# Altium schematic sheet adc.SchDoc: ADC
size A4; Organization: Altium Limited; Address1: L3, 12a Rodborough Rd; Address2: Frenchs Forest; Address3: NSW; Address4: Australia 2086; DocumentNumber: 1; Revision: 1
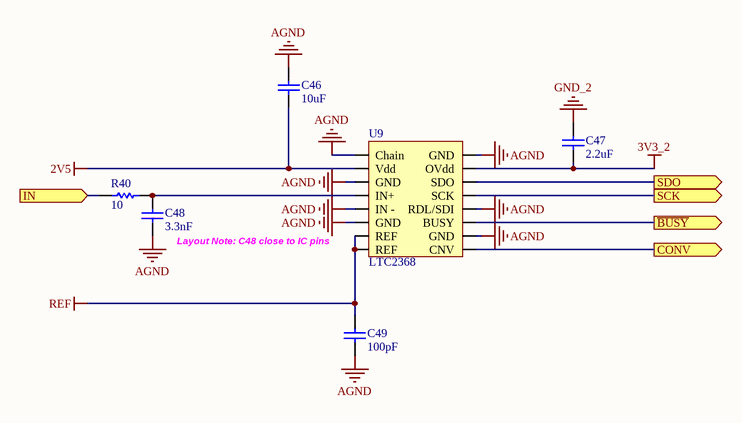
[diagram p0: adc.SchDoc]

## Parts
C46  10uF  [0402_Cap]
C47  2.2uF  [0402_Cap]
C48  3.3nF  [0402_Cap]
C49  100pF  [STD_0805_C]
R40  10  [0402_Res]
U9  LTC2368  [MSOP_16]

## Ports
CONV (out), IN (in), SCK (out), SDO (out), ~{BUSY} (out)

## Nets
2V5: C46.1 U9.2(Vdd)
3V3_2: C47.1 U9.15(OVdd)
AGND: C46.2 C48.1 C49.1 U9.1(Chain) U9.3(GND) U9.5(IN_-) U9.6(GND) U9.10(GND) U9.12(RDL/SDI) U9.16(GND)
GND_2: C47.2
REF: C49.2 U9.7(REF) U9.8(REF)
~{BUSY}: U9.11(BUSY) ; port ~{BUSY}
CONV: U9.9(CNV) ; port CONV
IN: R40.1 ; port IN
SCK: U9.13(SCK) ; port SCK
SDO: U9.14(SDO) ; port SDO
NetC48_2: C48.2 R40.2 U9.4(IN+)

## Notes on the sheet
- Layout Note: C48 close to IC pins
- Title
- Date:
- RE:
- Arturo di Girolamo
- Size:
- A3
- A

## Library data of the parts
C46 = CL21A106KAFN3NE: Capacitor, 10uF, 0805; Value: .01uf; ASYPN: CL05A106MQ5NUNC; MFGPN: CL21A106KAFN3NE
C47 = CL21A225KAFNNNE: Capacitor, 2.2uF, 0805; Value: .01uf; ASYPN: CL05A225KP5NNNC; MFGPN: CL21A225KAFNNNE
C48 = C0805C332KARACAUTO: Capacitor, 3.3nF, 0805; Value: .01uf; ASYPN: GRM1557U1A332JA01D; MFGPN: C0805C332KARACAUTO
C49 = CL21C101JCANNNC: Capacitor, 100pF, 0805; Value: .01uf; ASYPN: 885012205001; MFGPN: CL21C101JCANNNC
R40 = RNCF0805DTE10R0: 10 ohm 0805; ASYPN: PFR05S-100-FNH; Value: 10; MFGPN: RNCF0805DTE10R0
U9 = LTC2368: ASYPN: LTC2368IMS-24#PBF